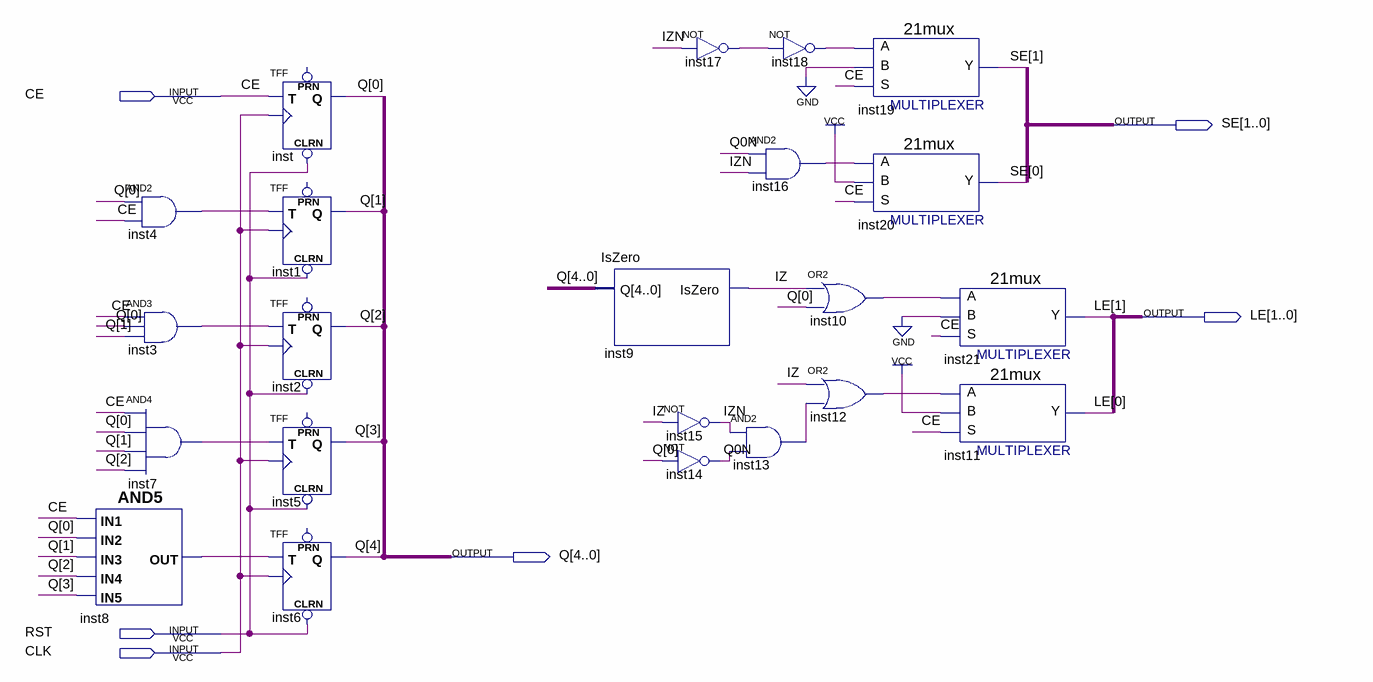
[diagram p0: schematic sheet]
// Quartus schematic Counter8.bdf as structural Verilog: 22 symbols, 6 pins
module Counter8 (
  input  CE,
  input  RST,
  input  CLK,
  output [1:0] SE,
  output [1:0] LE,
  output [4:0] Q
);

  wire inst3_out, inst4_out, inst7_out, inst8_out, inst10_out, inst12_out, inst13_out, inst16_out,
       inst17_out, inst18_out, IZ, IZN, Q0N;

  and inst8 (inst8_out, CE, Q[0], Q[1], Q[2], Q[3]);
  and inst4 (inst4_out, Q[0], CE);
  and inst3 (inst3_out, CE, Q[0], Q[1]);
  and inst7 (inst7_out, CE, Q[0], Q[1], Q[2]);
  TFF inst (.CLRN(RST), .T(CE), .CLK(CLK), .Q(Q[0]));  // open: PRN
  TFF inst1 (.CLRN(RST), .T(inst4_out), .CLK(CLK), .Q(Q[1]));  // open: PRN
  TFF inst2 (.CLRN(RST), .T(inst3_out), .CLK(CLK), .Q(Q[2]));  // open: PRN
  TFF inst5 (.CLRN(RST), .T(inst7_out), .CLK(CLK), .Q(Q[3]));  // open: PRN
  TFF inst6 (.CLRN(RST), .T(inst8_out), .CLK(CLK), .Q(Q[4]));  // open: PRN
  IsZero inst9 (.Q(Q), .IsZero(IZ));
  not inst17 (inst17_out, IZN);
  not inst15 (IZN, IZ);
  not inst14 (Q0N, Q[0]);
  not inst18 (inst18_out, inst17_out);
  and inst16 (inst16_out, Q0N, IZN);
  and inst13 (inst13_out, IZN, Q0N);
  \21mux  inst19 (.S(CE), .B(1'b0), .A(inst18_out), .Y(SE[1]));
  \21mux  inst20 (.S(CE), .B(1'b1), .A(inst16_out), .Y(SE[0]));
  or inst10 (inst10_out, IZ, Q[0]);
  or inst12 (inst12_out, IZ, inst13_out);
  \21mux  inst21 (.S(CE), .B(1'b0), .A(inst10_out), .Y(LE[1]));
  \21mux  inst11 (.S(CE), .B(1'b1), .A(inst12_out), .Y(LE[0]));
endmodule
